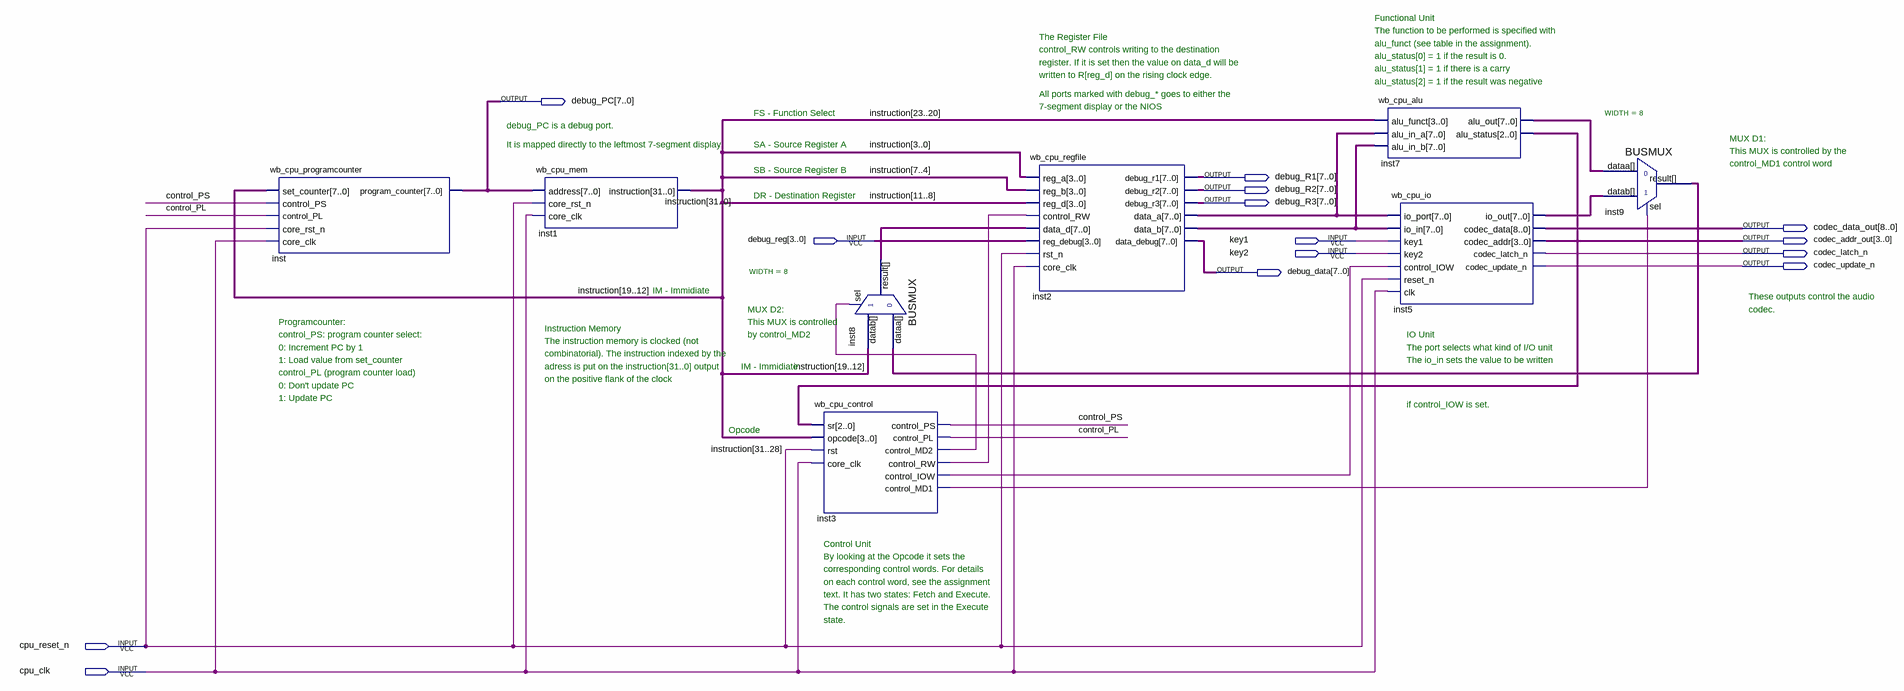
[diagram p0: schematic sheet]
// Quartus schematic wb_processor.bdf as structural Verilog: 8 symbols, 14 pins
module wb_processor (
  input  [3:0] debug_reg,
  input  key1,
  input  key2,
  input  cpu_reset_n,
  input  cpu_clk,
  output [7:0] debug_PC,
  output [7:0] debug_R1,
  output [7:0] debug_R2,
  output [7:0] debug_R3,
  output [8:0] codec_data_out,
  output [3:0] codec_addr_out,
  output codec_latch_n,
  output codec_update_n,
  output [7:0] debug_data
);

  wire control_PL, control_PS, inst3_control_iow, inst3_control_md1, inst3_control_md2, inst3_control_rw;
  wire [2:0] inst7_alu_status;
  wire [7:0] inst2_data_a, inst2_data_b, inst5_io_out, inst7_alu_out, inst8_result, inst9_result;
  wire [31:0] instruction;

  wb_cpu_programcounter inst (
    .set_counter(instruction[19:12]), .control_PS(control_PS), .control_PL(control_PL),
    .core_rst_n(cpu_reset_n), .core_clk(cpu_clk), .program_counter(debug_PC));
  wb_cpu_mem inst1 (.address(debug_PC), .core_rst_n(cpu_reset_n), .core_clk(cpu_clk), .instruction(instruction));
  wb_cpu_control inst3 (
    .sr(inst7_alu_status), .opcode(instruction[31:28]), .rst(cpu_reset_n), .core_clk(cpu_clk),
    .control_PS(control_PS), .control_PL(control_PL), .control_MD2(inst3_control_md2),
    .control_RW(inst3_control_rw), .control_IOW(inst3_control_iow), .control_MD1(inst3_control_md1));
  BUSMUX #(.WIDTH(8)) inst8 (
    .datab(instruction[19:12]), .sel(inst3_control_md2), .dataa(inst9_result), .result(inst8_result));
  wb_cpu_regfile inst2 (
    .reg_a(instruction[3:0]), .reg_b(instruction[7:4]), .reg_d(instruction[11:8]),
    .control_RW(inst3_control_rw), .data_d(inst8_result), .reg_debug(debug_reg), .rst_n(cpu_reset_n),
    .core_clk(cpu_clk), .debug_r1(debug_R1), .debug_r2(debug_R2), .debug_r3(debug_R3), .data_a(inst2_data_a),
    .data_b(inst2_data_b), .data_debug(debug_data));
  wb_cpu_alu inst7 (
    .alu_funct(instruction[23:20]), .alu_in_a(inst2_data_a), .alu_in_b(inst2_data_b),
    .alu_out(inst7_alu_out), .alu_status(inst7_alu_status));
  wb_cpu_io inst5 (
    .io_port(inst2_data_a), .io_in(inst2_data_b), .key1(key1), .key2(key2), .control_IOW(inst3_control_iow),
    .reset_n(cpu_reset_n), .clk(cpu_clk), .io_out(inst5_io_out), .codec_data(codec_data_out),
    .codec_addr(codec_addr_out), .codec_latch_n(codec_latch_n), .codec_update_n(codec_update_n));
  BUSMUX #(.WIDTH(8)) inst9 (
    .datab(inst5_io_out), .sel(inst3_control_md1), .dataa(inst7_alu_out), .result(inst9_result));

  // Notes on the sheet:
  //   Functional Unit
  //   The function to be performed is specified with
  //   The Register File
  //   alu_funct (see table in the assignment).
  //   control_RW controls writing to the destination
  //   alu_status[0] = 1 if the result is 0.
  //   register. If it is set then the value on data_d will be
  //   alu_status[1] = 1 if there is a carry
  //   written to R[reg_d] on the rising clock edge.
  //   alu_status[2] = 1 if the result was negative
  //   All ports marked with debug_* goes to either the
  //   7-segment display or the NIOS
  //   FS - Function Select
  //   debug_PC is a debug port.
  //   MUX D1:
  //   It is mapped directly to the leftmost 7-segment display
  //   SA - Source Register A
  //   This MUX is controlled by the
  //   control_MD1 control word
  //   SB - Source Register B
  //   DR - Destination Register
  //   IM - Immidiate
  //   These outputs control the audio
  //   MUX D2:
  //   codec.
  //   Programcounter:
  //   This MUX is controlled
  //   Instruction Memory
  //   control_PS: program counter select:
  //   by control_MD2
  //   IO Unit
  //   The instruction memory is clocked (not
  //   0: Increment PC by 1
  //   The port selects what kind of I/O unit
  //   combinatorial). The instruction indexed by the
  //   1: Load value from set_counter
  //   The io_in sets the value to be written
  //   adress is put on the instruction[31..0] output
  //   IM - Immidiate
  //   control_PL (program counter load)
  //   on the positive flank of the clock
  //   0: Don't update PC
  //   1: Update PC
  //   if control_IOW is set.
  //   Opcode
  //   Control Unit
  //   By looking at the Opcode it sets the
  //   corresponding control words. For details
  //   on each control word, see the assignment
  //   text. It has two states: Fetch and Execute.
  //   The control signals are set in the Execute
  //   state.
endmodule
